# Altium schematic sheet crw.SchDoc
size A
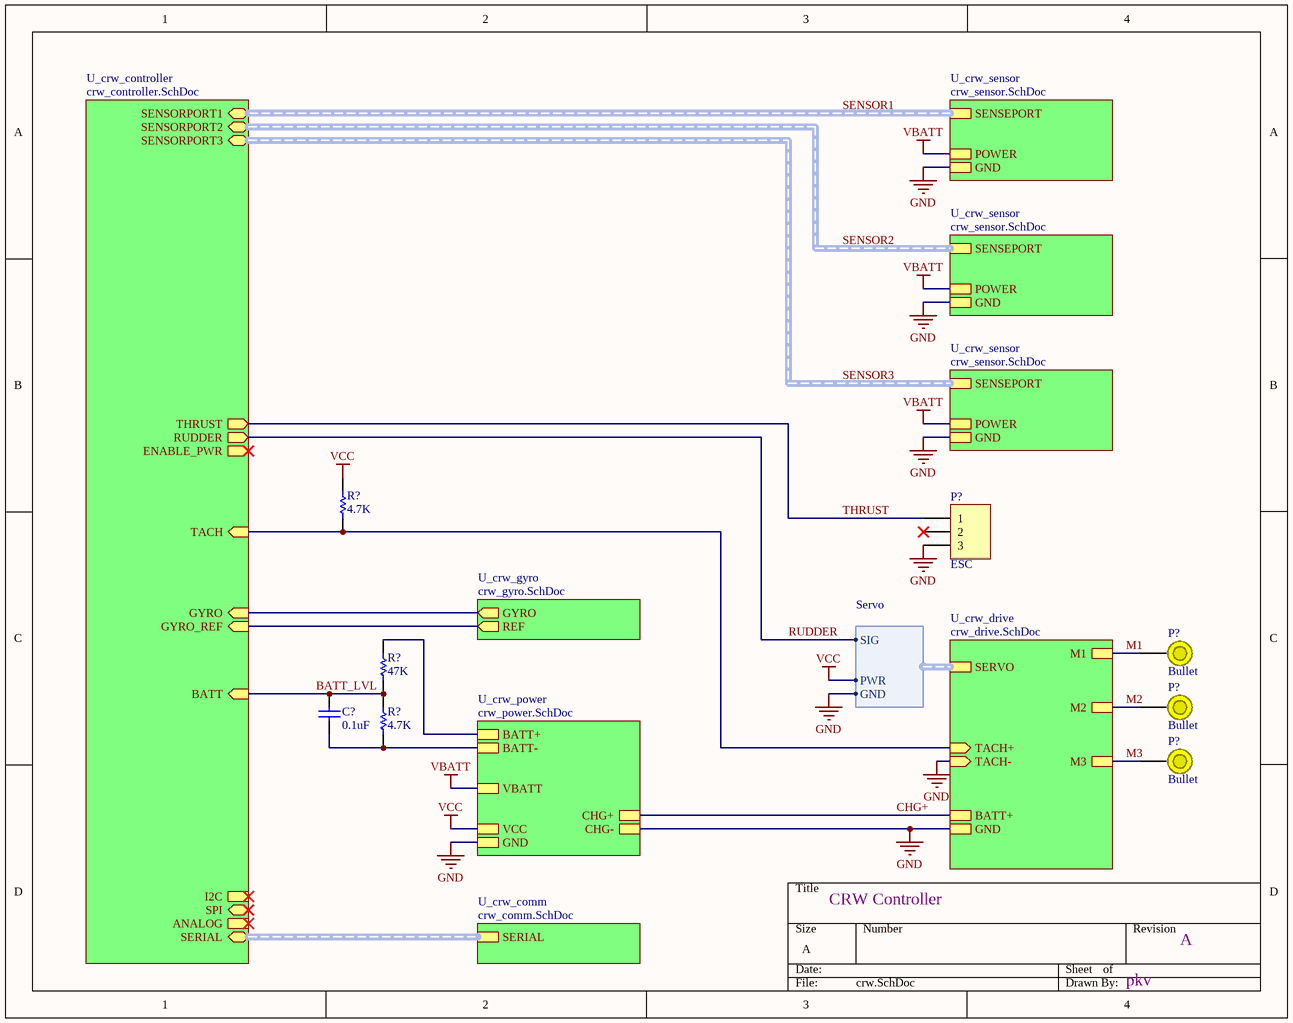
[diagram p0: crw.SchDoc]

## Parts
(Parts that share a designator on the sheet are numbered #1, #2 ... from top to bottom, then left to right.)
C?  value 0.1uF  [0805]  (hidden comment: C0805)
P?#1  ESC  [HDR1X3H]
P?#2  Bullet
P?#3  Bullet
P?#4  Bullet
R?#1  value 4.7K  [2012[0805]]  (hidden comment: Res Semi)
R?#2  value 47K  [2012[0805]]  (hidden comment: Res Semi)
R?#3  value 4.7K  [2012[0805]]  (hidden comment: Res Semi)

## Sub-sheets
U_crw_comm = crw_comm.SchDoc: SERIAL (harness Serial)
U_crw_controller = crw_controller.SchDoc: RUDDER (out), THRUST (out), ANALOG (harness Analog), BATT (in), GYRO (in), I2C (harness I2C), ENABLE_PWR (out), SENSORPORT3 (harness SensorPort), SENSORPORT2 (harness SensorPort), SENSORPORT1 (harness SensorPort), SERIAL (harness Serial), TACH (in), GYRO_REF (in), SPI (harness SPI)
U_crw_drive = crw_drive.SchDoc: GND, M1, M2, M3, SERVO (harness Servo), BATT+, TACH+ (in), TACH- (in)
U_crw_gyro = crw_gyro.SchDoc: GYRO (out), REF (out)
U_crw_power = crw_power.SchDoc: BATT+, BATT-, VBATT, GND, CHG+, CHG-, VCC
U_crw_sensor = crw_sensor.SchDoc: SENSEPORT (harness SensorPort), POWER, GND
U_crw_sensor = crw_sensor.SchDoc: SENSEPORT (harness SensorPort), POWER, GND
U_crw_sensor = crw_sensor.SchDoc: SENSEPORT (harness SensorPort), POWER, GND

## Harnesses
Servo: GND, PWR, SIG

## Nets
GND: P?#1.3 ; sheet U_crw_drive/GND, sheet U_crw_drive/TACH-, sheet U_crw_sensor/GND, sheet U_crw_sensor/GND, sheet U_crw_sensor/GND, sheet U_crw_power/GND, sheet U_crw_power/CHG-, sheet U_crw_drive/SERVO.GND
VBATT: sheet U_crw_sensor/POWER, sheet U_crw_sensor/POWER, sheet U_crw_sensor/POWER, sheet U_crw_power/VBATT
VCC: R?#1.1 ; sheet U_crw_power/VCC, sheet U_crw_drive/SERVO.PWR
BATT_LVL: C?.1 R?#2.2 R?#3.1 ; sheet U_crw_controller/BATT
CHG+: sheet U_crw_drive/BATT+, sheet U_crw_power/CHG+
M1: P?#2.1 ; sheet U_crw_drive/M1
M2: P?#3.1 ; sheet U_crw_drive/M2
M3: P?#4.1 ; sheet U_crw_drive/M3
RUDDER: sheet U_crw_controller/RUDDER, sheet U_crw_drive/SERVO.SIG
THRUST: P?#1.1 ; sheet U_crw_controller/THRUST
NetC?_2: C?.2 R?#3.2 ; sheet U_crw_power/BATT-
NetR?#1_2: R?#1.2 ; sheet U_crw_controller/TACH, sheet U_crw_drive/TACH+
NetR?#2_1: R?#2.1 ; sheet U_crw_power/BATT+
(unnamed): sheet U_crw_controller/GYRO, sheet U_crw_gyro/GYRO
(unnamed): sheet U_crw_controller/GYRO_REF, sheet U_crw_gyro/REF

Not connected (* = marked no-connect by the designer): P?#1 2*

## Buses and harness runs
harness SENSOR1 = sheet U_crw_controller/SENSORPORT1 = sheet U_crw_sensor/SENSEPORT
harness SENSOR2 = sheet U_crw_controller/SENSORPORT2 = sheet U_crw_sensor/SENSEPORT
harness SENSOR3 = sheet U_crw_controller/SENSORPORT3 = sheet U_crw_sensor/SENSEPORT
harness sheet U_crw_comm/SERIAL = sheet U_crw_controller/SERIAL

## Notes on the sheet
- CRW Controller
- A
- pkv

## Library data of the parts
C? = C0805: Ceramic Chip Capacitor - Standard; Note: Footprint corresponds to dimensions for bulk cassette packaging. This case size has tightened tolerances.; Published: 17-Jul-2002; LatestRevisionDate: 19-Mar-2004; LatestRevisionNote: Silkscreen size reduced.; DatasheetDocument: Mar-2001; PackageDocument: Mar-2001; PackageReference: 0805; Publisher: Altium Limited; Code_JEITA: 0805; Code_IPC: 2012[0805]; ComponentLink1Description: Manufacturer Link; ComponentLink1URL: http://www.kemet.com/; ComponentLink2Description: Datasheet; ComponentLink2URL: http://www.kemet.com/kemet/web/homepage/kechome.nsf/vapubfilesname/F3102TA.pdf/$file/F3102TA.pdf
P?#1 = Header 3H: Header, 3-Pin, Right Angle; LatestRevisionDate: 17-Jul-2002; LatestRevisionNote: Re-released for DXP Platform.; Publisher: Altium Limited
P?#2-P?#4 = BulletConnector: 3.5mm Plated Bullet Style Connector
R?#1-R?#3 = Res Semi: Semiconductor Resistor; Published: 8-Jun-2000; LatestRevisionDate: 17-Jul-2002; LatestRevisionNote: Re-released for DXP Platform.; PackageReference: AXIAL-0.5; Publisher: Altium Limited